# EAGLE design Sidekick-v02 (EAGLE 5.09)
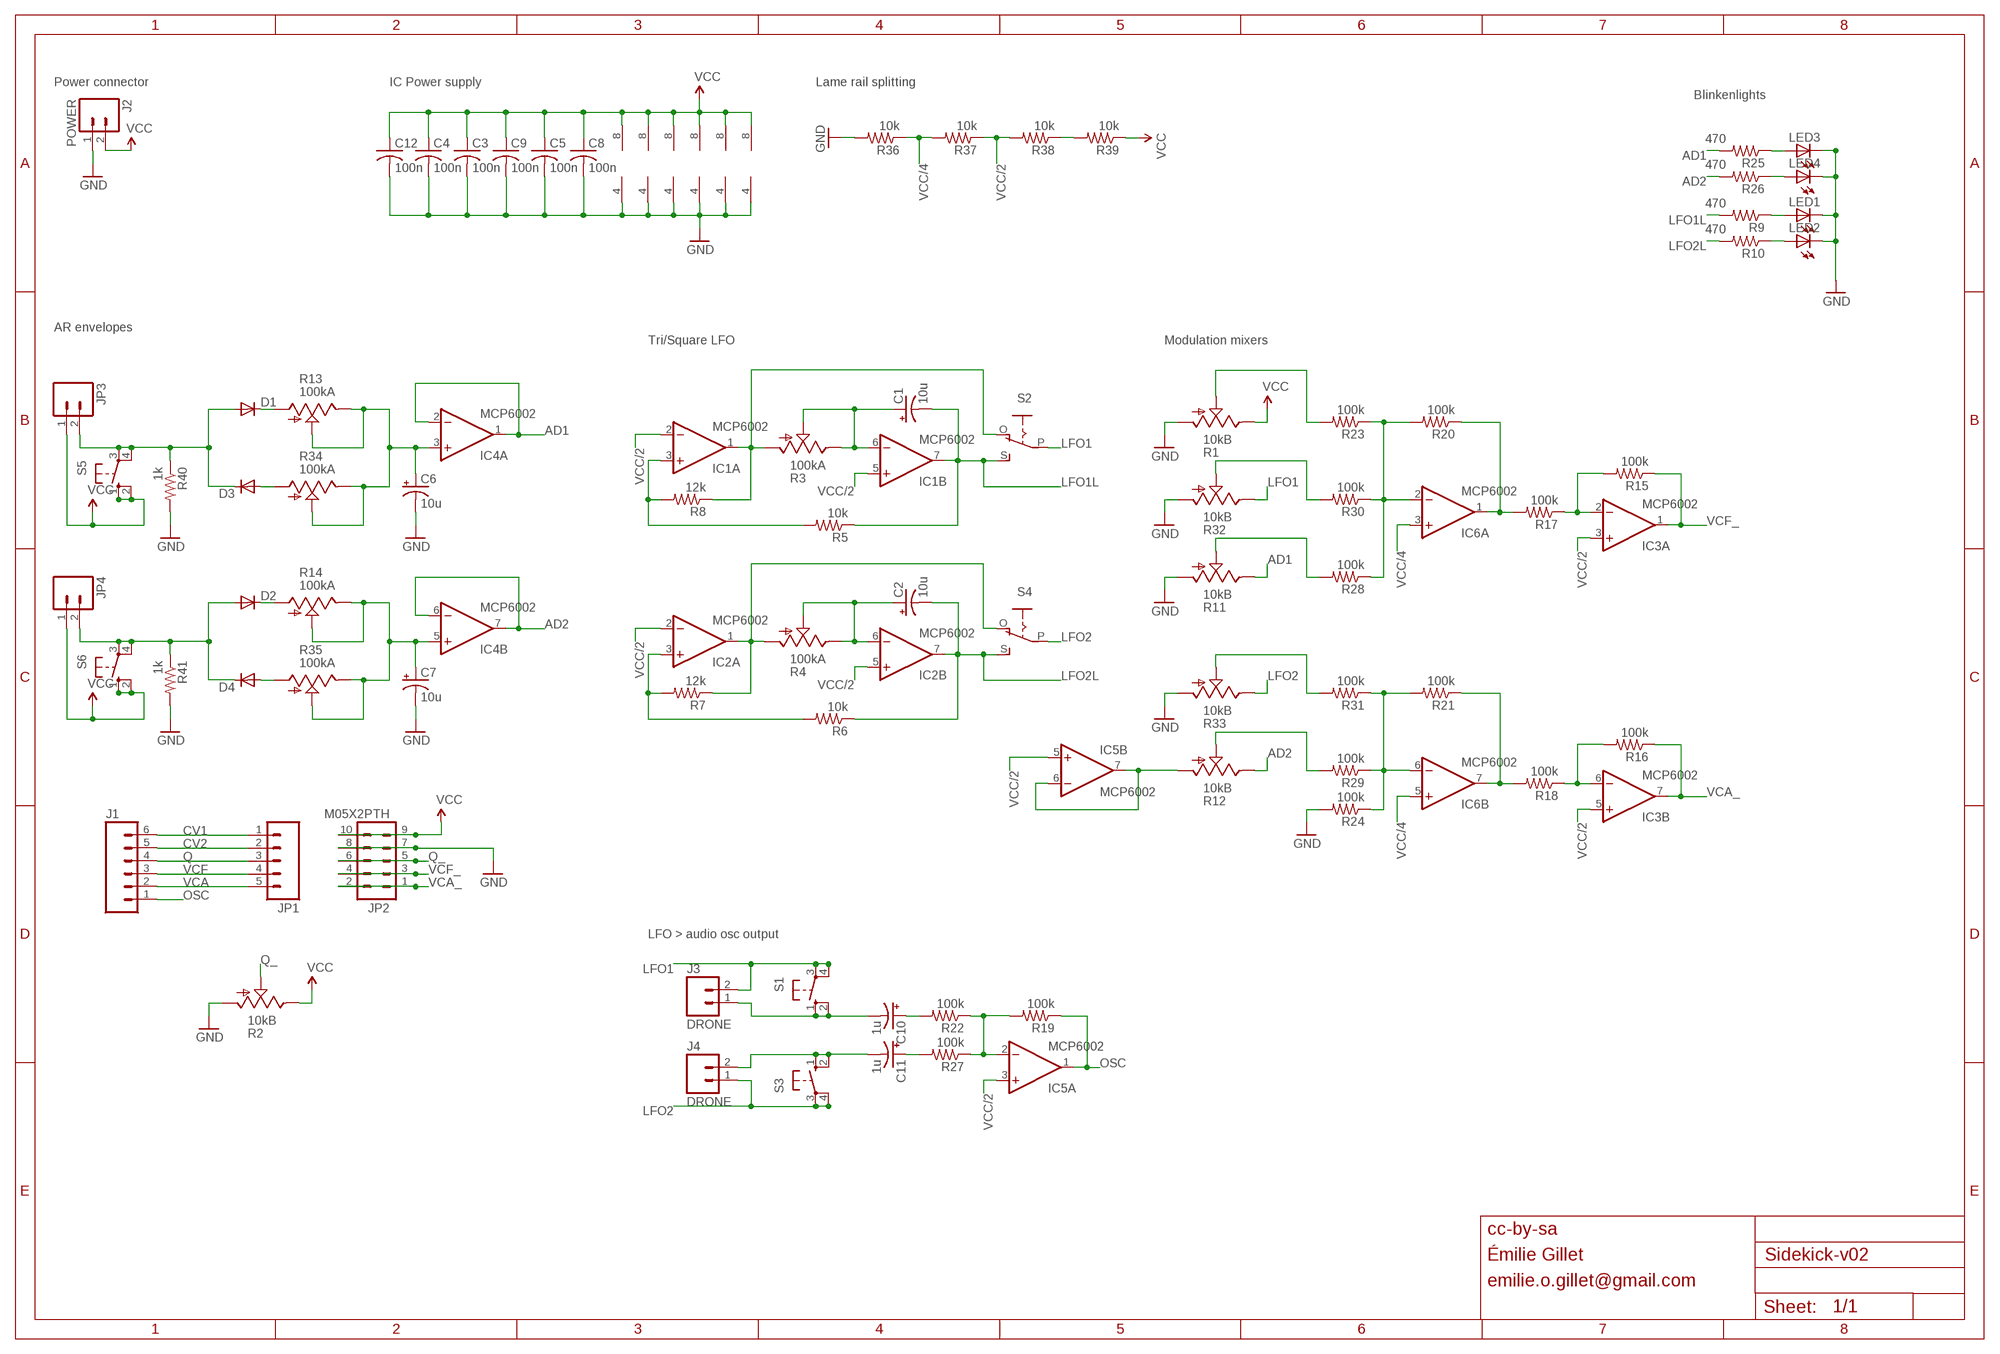
[diagram p0: schematic, sheet 1]

## Parts
C1  10u  CPOL-USE2.5-6  [E2,5-6]
C2  10u  CPOL-USE2.5-6  [E2,5-6]
C3  100n  C-US025-024X044  [C025-024X044]
C4  100n  C-US025-024X044  [C025-024X044]
C5  100n  C-US025-024X044  [C025-024X044]
C6  10u  CPOL-USE2.5-6  [E2,5-6]
C7  10u  CPOL-USE2.5-6  [E2,5-6]
C8  100n  C-US025-024X044  [C025-024X044]
C9  100n  C-US025-024X044  [C025-024X044]
C10  1u  CPOL-USE2.5-6  [E2,5-6]
C11  1u  CPOL-USE2.5-6  [E2,5-6]
C12  100n  C-US025-024X044  [C025-024X044]
D1  DIODE-D-5  [D-5]
D2  DIODE-D-5  [D-5]
D3  DIODE-D-5  [D-5]
D4  DIODE-D-5  [D-5]
IC1  MCP6002  TL082P  [DIL08]
IC2  MCP6002  TL082P  [DIL08]
IC3  MCP6002  TL082P  [DIL08]
IC4  MCP6002  TL082P  [DIL08]
IC5  MCP6002  TL082P  [DIL08]
IC6  MCP6002  TL082P  [DIL08]
J1  M06SIP  [1X06]
J2  POWER  M02PTH  [1X02]
J3  DRONE  M02PTH  [1X02]
J4  DRONE  M02PTH  [1X02]
JP1  M05PTH  [1X05]
JP2  M05X2PTH  [AVR_ICSP]
JP3  M02  [1X02_LONGPADS]
JP4  M02  [1X02_LONGPADS]
LED1  LED3MM  [LED3MM]
LED2  LED3MM  [LED3MM]
LED3  LED3MM  [LED3MM]
LED4  LED3MM  [LED3MM]
R1  10kB  POT_US  [ALPS_POT_SFE]
R2  10kB  POT_US  [ALPS_POT_SFE]
R3  100kA  POT_US  [ALPS_POT_SFE]
R4  100kA  POT_US  [ALPS_POT_SFE]
R5  10k  R-US_0204/7  [0204/7]
R6  10k  R-US_0204/7  [0204/7]
R7  12k  R-US_0204/7  [0204/7]
R8  12k  R-US_0204/7  [0204/7]
R9  470  R-US_0204/7  [0204/7]
R10  470  R-US_0204/7  [0204/7]
R11  10kB  POT_US  [ALPS_POT_SFE]
R12  10kB  POT_US  [ALPS_POT_SFE]
R13  100kA  POT_US  [ALPS_POT_SFE]
R14  100kA  POT_US  [ALPS_POT_SFE]
R15  100k  R-US_0204/7  [0204/7]
R16  100k  R-US_0204/7  [0204/7]
R17  100k  R-US_0204/7  [0204/7]
R18  100k  R-US_0204/7  [0204/7]
R19  100k  R-US_0204/7  [0204/7]
R20  100k  R-US_0204/7  [0204/7]
R21  100k  R-US_0204/7  [0204/7]
R22  100k  R-US_0204/7  [0204/7]
R23  100k  R-US_0204/7  [0204/7]
R24  100k  R-US_0204/7  [0204/7]
R25  470  R-US_0204/7  [0204/7]
R26  470  R-US_0204/7  [0204/7]
R27  100k  R-US_0204/7  [0204/7]
R28  100k  R-US_0204/7  [0204/7]
R29  100k  R-US_0204/7  [0204/7]
R30  100k  R-US_0204/7  [0204/7]
R31  100k  R-US_0204/7  [0204/7]
R32  10kB  POT_US  [ALPS_POT_SFE]
R33  10kB  POT_US  [ALPS_POT_SFE]
R34  100kA  POT_US  [ALPS_POT_SFE]
R35  100kA  POT_US  [ALPS_POT_SFE]
R36  10k  R-US_0204/7  [0204/7]
R37  10k  R-US_0204/7  [0204/7]
R38  10k  R-US_0204/7  [0204/7]
R39  10k  R-US_0204/7  [0204/7]
R40  1k  R-US_0204/7  [0204/7]
R41  1k  R-US_0204/7  [0204/7]
S1  40-XX  [B3F-40XX]
S2  EG1218S  [EG1218]
S3  40-XX  [B3F-40XX]
S4  EG1218S  [EG1218]
S5  40-XX  [B3F-40XX]
S6  40-XX  [B3F-40XX]

## Nets
AD1: IC4.1(A:OUT) IC4.2(A:-IN) R11.P$1(E) R25.2
AD2: IC4.6(B:-IN) IC4.7(B:OUT) R12.P$1(E) R26.2
CV1: J1.6 JP1.1
CV2: J1.5 JP1.2
GND: C3.2 C4.2 C5.2 C6.- C7.- C8.2 C9.2 C12.2 IC1.4(P:V-) IC2.4(P:V-) IC3.4(P:V-) IC4.4(P:V-) IC5.4(P:V-) IC6.4(P:V-) J2.1 JP2.7 JP2.8 LED1.K(C) LED2.K(C) LED3.K(C) LED4.K(C) R1.P$3(A) R2.P$3(A) R11.P$3(A) R24.2 R32.P$3(A) R33.P$3(A) R36.2 R40.2 R41.2
LFO1: J3.2 R32.P$1(E) S1.3(P) S1.4(P1) S2.P
LFO1L: C1.- IC1.7(B:OUT) R5.1 R9.2 S2.S
LFO2: J4.1 R33.P$1(E) S3.3(P) S3.4(P1) S4.P
LFO2L: C2.- IC2.7(B:OUT) R6.1 R10.2 S4.S
N$1: C11.- J4.2 S3.1(S) S3.2(S1)
N$2: D1.C R13.P$3(A)
N$3: D3.A R34.P$3(A)
N$4: R30.2 R32.P$2(S)
N$5: D2.C R14.P$3(A)
N$6: D4.A R35.P$3(A)
N$7: C6.+ IC4.3(A:+IN) R13.P$1(E) R13.P$2(S) R34.P$1(E) R34.P$2(S)
N$8: C7.+ IC4.5(B:+IN) R14.P$1(E) R14.P$2(S) R35.P$1(E) R35.P$2(S)
N$9: IC6.2(A:-IN) R20.2 R23.1 R28.1 R30.1
N$10: D1.A D3.C JP3.2 R40.1 S5.3(P) S5.4(P1)
N$11: D2.A D4.C JP4.2 R41.1 S6.3(P) S6.4(P1)
N$12: C1.+ IC1.6(B:-IN) R3.P$1(E) R3.P$2(S)
N$13: LED3.A R25.1
N$14: LED4.A R26.1
N$15: R1.P$2(S) R23.2
N$16: R11.P$2(S) R28.2
N$17: IC6.1(A:OUT) R17.2 R20.1
N$18: IC3.2(A:-IN) R15.2 R17.1
N$19: IC6.6(B:-IN) R21.2 R24.1 R29.1 R31.1
N$20: R31.2 R33.P$2(S)
N$21: R12.P$2(S) R29.2
N$22: IC1.3(A:+IN) R5.2 R8.2
N$23: IC6.7(B:OUT) R18.2 R21.1
N$24: IC3.6(B:-IN) R16.2 R18.1
N$25: IC1.1(A:OUT) R3.P$3(A) R8.1 S2.O
N$26: IC2.3(A:+IN) R6.2 R7.2
N$28: C2.+ IC2.6(B:-IN) R4.P$1(E) R4.P$2(S)
N$29: IC2.1(A:OUT) R4.P$3(A) R7.1 S4.O
N$32: IC5.2(A:-IN) R19.2 R22.1 R27.1
N$34: LED1.A R9.1
N$35: R38.1 R39.2
N$36: LED2.A R10.1
N$43: C11.+ R27.2
N$44: C10.+ R22.2
N$46: C10.- J3.1 S1.1(S) S1.2(S1)
NETX: IC5.6(B:-IN) IC5.7(B:OUT) R12.P$3(A)
OSC: IC5.1(A:OUT) J1.1 R19.1
Q: J1.4 JP1.3
Q_: JP2.5 JP2.6 R2.P$2(S)
VCA: J1.2 JP1.5
VCA_: IC3.7(B:OUT) JP2.1 JP2.2 R16.1
VCC: C3.1 C4.1 C5.1 C8.1 C9.1 C12.1 IC1.8(P:V+) IC2.8(P:V+) IC3.8(P:V+) IC4.8(P:V+) IC5.8(P:V+) IC6.8(P:V+) J2.2 JP2.9 JP2.10 JP3.1 JP4.1 R1.P$1(E) R2.P$1(E) R39.1 S5.1(S) S5.2(S1) S6.1(S) S6.2(S1)
VCC/2: IC1.2(A:-IN) IC1.5(B:+IN) IC2.2(A:-IN) IC2.5(B:+IN) IC3.3(A:+IN) IC3.5(B:+IN) IC5.3(A:+IN) IC5.5(B:+IN) R37.1 R38.2
VCC/4: IC6.3(A:+IN) IC6.5(B:+IN) R36.1 R37.2
VCF: J1.3 JP1.4
VCF_: IC3.1(A:OUT) JP2.3 JP2.4 R15.1

## Notes on the sheet
- Power connector | IC Power supply | Lame rail splitting
- Blinkenlights
- AR envelopes
- Tri/Square LFO | Modulation mixers
- LFO > audio osc output
- cc-by-sa
- Émilie Gillet
- emilie.o.gillet@gmail.com

## Library data of the parts
C1 C2 C6 C7 C10 C11 = rcl:CPOL-US: POLARIZED CAPACITOR, American symbol
C3-C5 C8 C9 C12 = rcl:C-US: CAPACITOR, American symbol
D1-D4 = diode:DIODE-: DIODE
IC1-IC6 = gm-ics:TL082: OP AMP
J1 = SparkFun:M06: Header 6 Standard 6-pin 0.1" header. Use with straight break away headers (SKU : PRT-00116), right angle break away headers (PRT-00553), swiss pins (PRT-00743), machine pins (PRT-00117), and female headers (PRT-00115). Molex polarized connector foot print use with SKU : PRT-08094 with associated crimp pins and housings. NOTES ON THE VARIANTS LOCK and LOCK_LONGPADS... This footprint was designed to help hold the alignment of a through-hole component (i.e. 6-pin header) while soldering it into place. You may notice that each hole has been shifted either up or down by 0.005 of an inch from it's more standard position (which is a perfectly straight line). This slight alteration caused the pins (the squares in the middle) to touch the edges of the holes. Because they are alternating, it causes a "brace" to hold the component in place. 0.005 has proven to be the perfect amount of "off-center" position when using our standard breakaway headers. Although looks a little odd when you look at the bare footprint, once you have a header in there, the alteration is very hard to notice. Also, if you push a header all the way into place, it is covered up entirely on the bottom side. This idea of altering the position of holes to aid alignment will be further integrated into the Sparkfun Library for other footprints. It can help hold any component with 3 or more connection pins.
J2-J4 JP3 JP4 = SparkFun:M02: Header 2 Standard 2-pin 0.1" header. Use with straight break away headers (SKU : PRT-00116), right angle break away headers (PRT-00553), swiss pins (PRT-00743), machine pins (PRT-00117), and female headers (PRT-00115). Molex polarized connector foot print use with SKU : PRT-08233 with associated crimp pins and housings.
JP1 = SparkFun:M05: Header 5 Standard 5-pin 0.1" header. Use with straight break away headers (SKU : PRT-00116), right angle break away headers (PRT-00553), swiss pins (PRT-00743), machine pins (PRT-00117), and female headers (PRT-00115). Molex polarized connector foot print use with SKU : PRT-08230 with associated crimp pins and housings.
JP2 = SparkFun:M05X2: Header 5x2 Standard 10-pin dual row 0.1" header. Commonly used with AVR-ISP. Use with Spark Fun Electronics SKU: PRT-00778
LED1-LED4 = led:LED: LED OSRAM: - CHIPLED LG R971, LG N971, LY N971, LG Q971, LY Q971, LO R971, LY R971 LH N974, LH R974 LS Q976, LO Q976, LY Q976 LO Q996 - Hyper CHIPLED LW Q18S LB Q993, LB Q99A, LB R99A - SideLED LS A670, LO A670, LY A670, LG A670, LP A670 LB A673, LV A673, LT A673, LW A673 LH A674 LY A675 LS A676, LA A676, LO A676, LY A676, LW A676 LS A679, LY A679, LG A679 - Hyper Micro SIDELED® LS Y876, LA Y876, LO Y876, LY Y876 LT Y87S - SmartLED LW L88C, LW L88S LB L89C, LB L89S, LG L890 LS L89K, LO L89K, LY L89K LS L896, LA L896, LO L896, LY L896 - TOPLED LS T670, LO T670, LY T670, LG T670, LP T670 LSG T670, LSP T670, LSY T670, LOP T670, LYG T670 LG T671, LOG T671, LSG T671 LB T673, LV T673, LT T673, LW T673 LH T674 LS T676, LA T676, LO T676, LY T676, LB T676, LH T676, LSB T676, LW T676 LB T67C, LV T67C, LT T67C, LS T67K, LO T67K, LY T67K, LW E67C LS E67B, LA E67B, LO E67B, LY E67B, LB E67C, LV E67C, LT E67C LW T67C LS T679, LY T679, LG T679 LS T770, LO T770, LY T770, LG T770, LP T770 LB T773, LV T773, LT T773, LW T773 LH T774 LS E675, LA E675, LY E675, LS T675 LS T776, LA T776, LO T776, LY T776, LB T776 LHGB T686 LT T68C, LB T68C - Hyper Mini TOPLED® LB M676 - Mini TOPLED Santana® LG M470 LS M47K, LO M47K, LY M47K Source: http://www.osram.convergy.de LUXEON: - LUMILED® LXK2-PW12-R00, LXK2-PW12-S00, LXK2-PW14-U00, LXK2-PW14-V00 LXK2-PM12-R00, LXK2-PM12-S00, LXK2-PM14-U00 LXK2-PE12-Q00, LXK2-PE12-R00, LXK2-PE12-S00, LXK2-PE14-T00, LXK2-PE14-U00 LXK2-PB12-K00, LXK2-PB12-L00, LXK2-PB12-M00, LXK2-PB14-N00, LXK2-PB14-P00, LXK2-PB14-Q00 LXK2-PR12-L00, LXK2-PR12-M00, LXK2-PR14-Q00, LXK2-PR14-R00 LXK2-PD12-Q00, LXK2-PD12-R00, LXK2-PD12-S00 LXK2-PH12-R00, LXK2-PH12-S00 LXK2-PL12-P00, LXK2-PL12-Q00, LXK2-PL12-R00 Source: www.luxeon.com KINGBRIGHT: KA-3528ASYC Source: www.kingbright.com
R1-R4 R11-R14 R32-R35 = pot-alps:POT_US
R5-R10 R15-R31 R36-R41 = rcl:R-US_: RESISTOR, American symbol
S1 S3 S5 S6 = og-switch:40-XX: OMRON SWITCH
S2 S4 = adafruit:EG1218: SLIDING SWITCH 0.1" spacing through hole, vertical SPDT slide switch http://www.ladyada.net/library/pcb/eaglelibrary.html

## Board
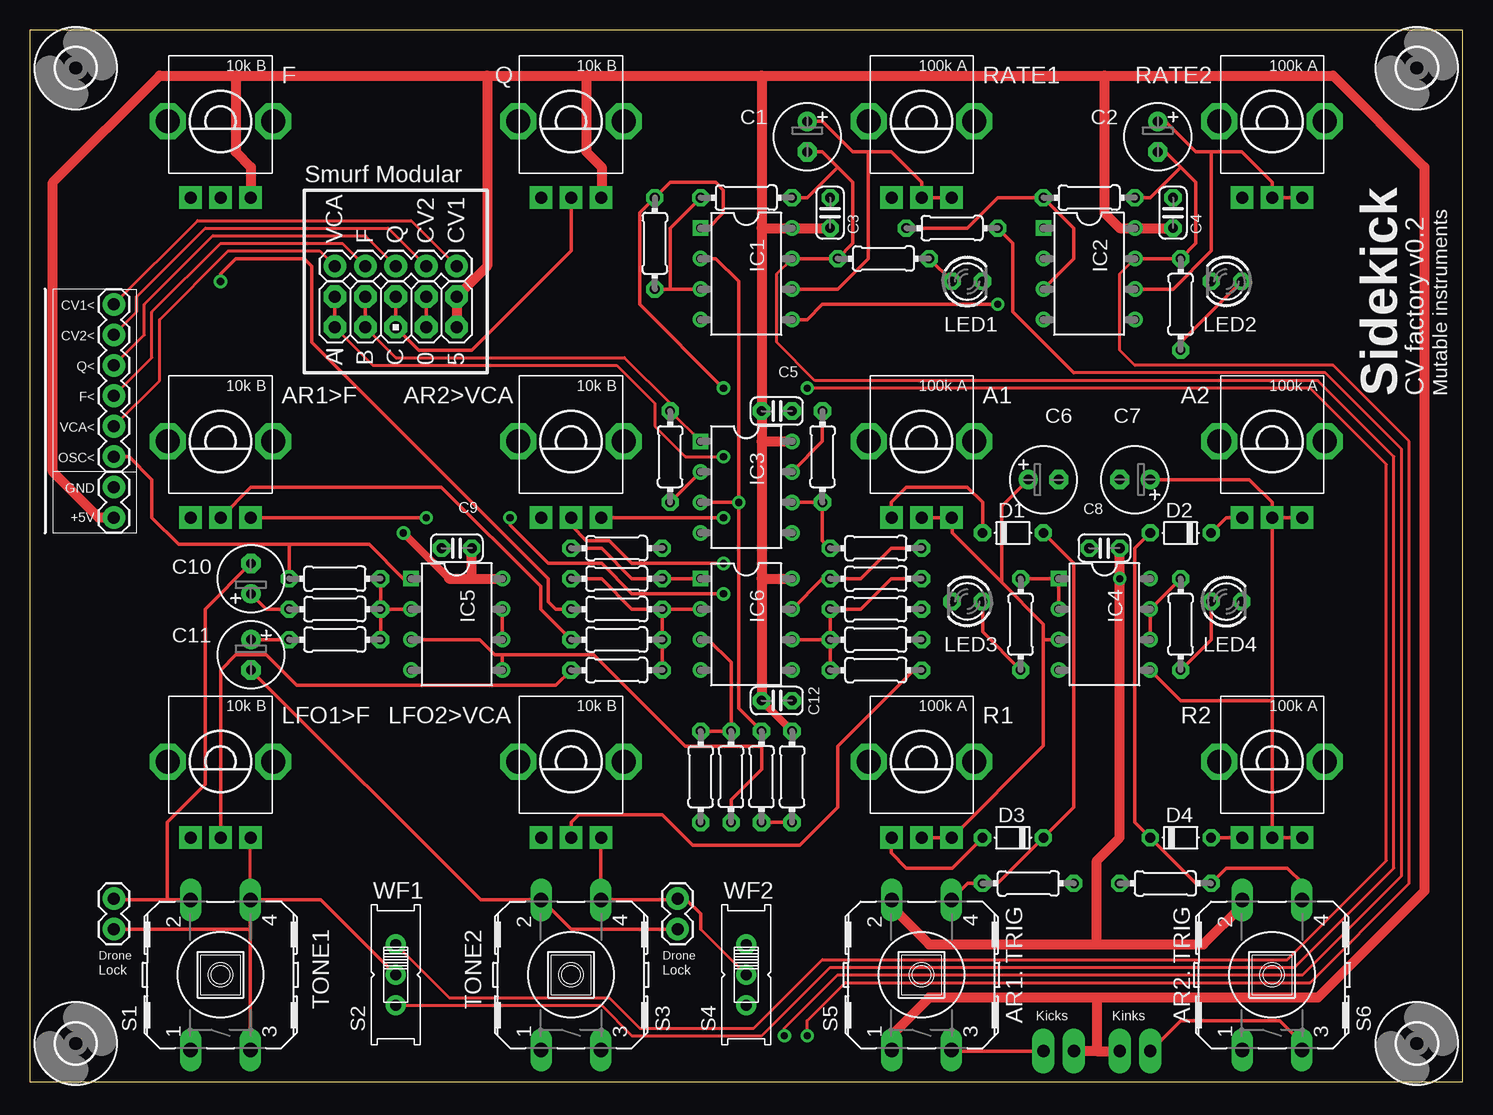
[diagram p1: board, top side]
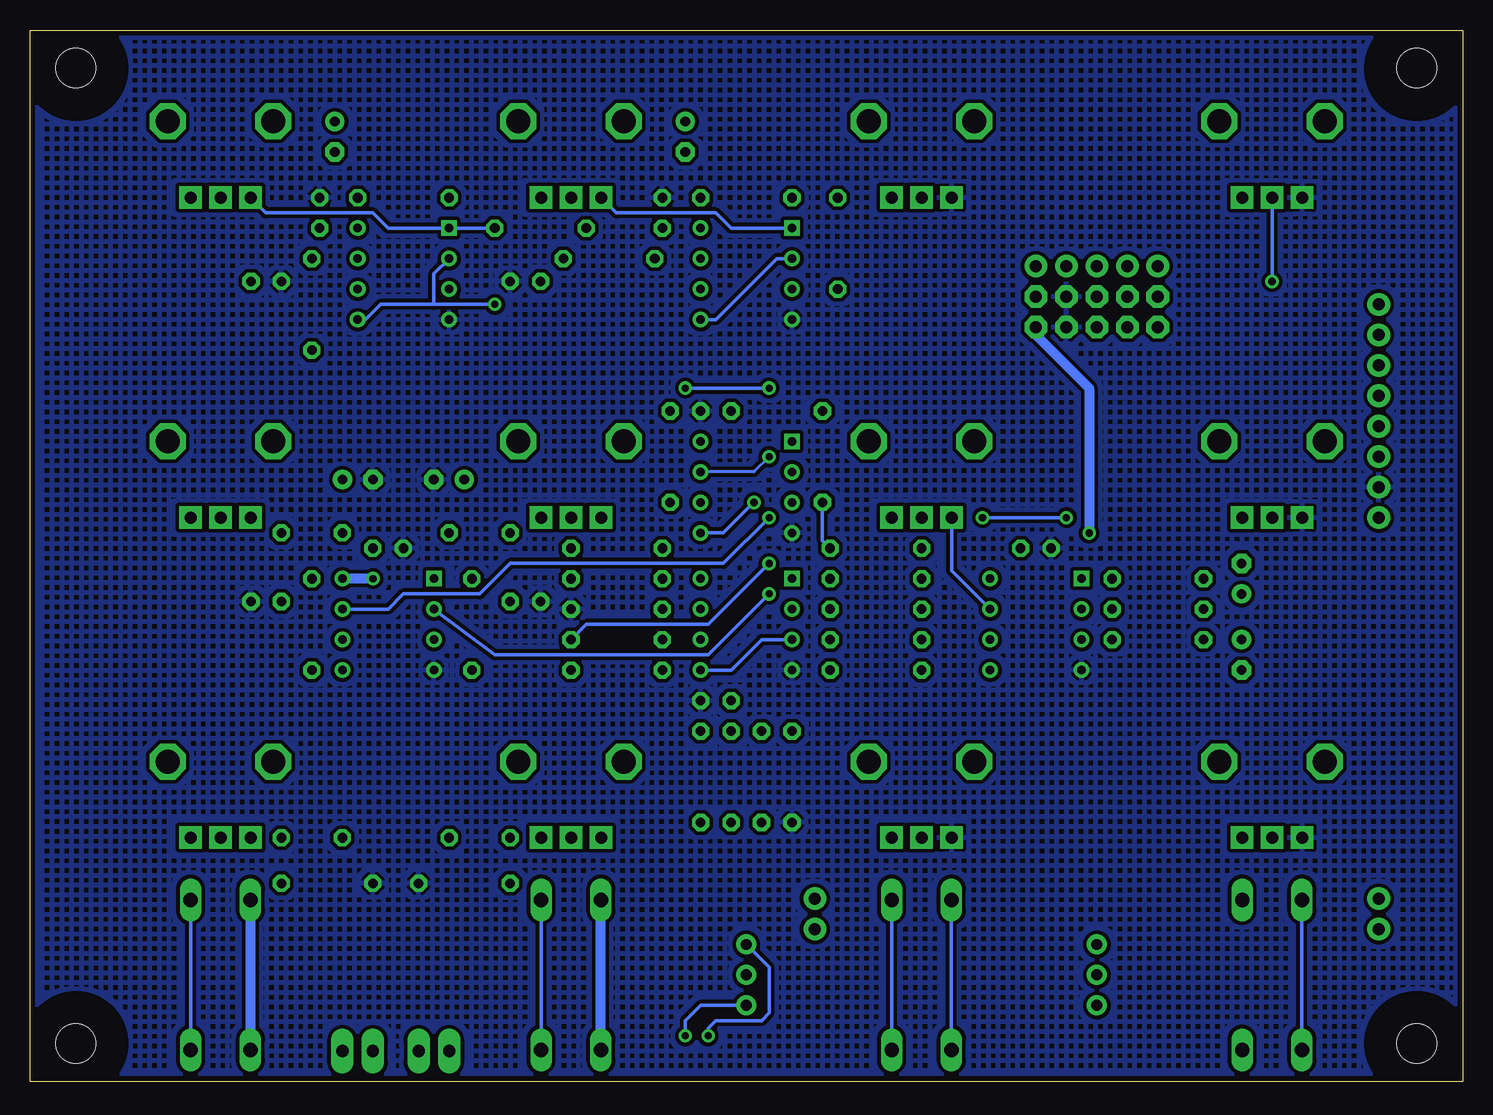
[diagram p2: board, bottom side, seen from below]

Size 119.38 x 87.63 mm. Coordinates in mm from the lower left corner, seen from the top.
Outline: 0,0 119.38,0 119.38,87.63 0,87.62 0,0
Copper layers (1*16): Top 0.035mm / dielectric 1.5mm / Bottom 0.035mm
Design rules "SparkFun *": minimum track width 8mil, minimum drill 20mil, track to track 8mil, track to pad 8mil, pad to pad 8mil, via to via 8mil, smd to smd 8mil, copper to edge 10mil, drill to drill 8mil, minimum pad ring 12mil, minimum via ring 10mil, stop-mask expansion 4mil, vias tented up to drill 25mil, thermal gap 10mil

### Footprints (pad centres in the part's own frame; a part is rotated, then mirrored left to right if it is on the bottom)
E2,5-6 = drill 0.813 pad 1.6 round: + -1.27,0 | drill 0.813 pad 1.6 octagon: - 1.27,0
C025-024X044 = drill 0.813 octagon: 1 -1.27,0; 2 1.27,0
D-5 = drill 0.813 octagon: A 2.54,0; C -2.54,0
DIL08 = drill 0.7 square: 1 -3.81,-3.81 | drill 0.7 round: 2 -1.27,-3.81; 3 1.27,-3.81; 4 3.81,-3.81; 5 3.81,3.81; 6 1.27,3.81; 7 -1.27,3.81; 8 -3.81,3.81
1X06 = drill 1.016 pad 1.88 round: 1 0,0; 2 2.54,0; 3 5.08,0; 4 7.62,0; 5 10.16,0; 6 12.7,0
1X02 = drill 1.016 pad 1.88 round: 1 0,0; 2 2.54,0
1X05 = drill 1.016 pad 1.88 round: 1 0,0; 2 2.54,0; 3 5.08,0; 4 7.62,0; 5 10.16,0
AVR_ICSP = drill 1.016 pad 1.88 octagon: 1 -1.27,5.08; 2 1.27,5.08; 3 -1.27,2.54; 4 1.27,2.54; 5 -1.27,0; 6 1.27,0; 7 -1.27,-2.54; 8 1.27,-2.54; 9 -1.27,-5.08; 10 1.27,-5.08
1X02_LONGPADS = drill 1.016 pad 1.88 long: 1 0,0; 2 2.54,0
LED3MM = drill 0.813 octagon: A -1.27,0; K 1.27,0
ALPS_POT_SFE = drill 1 pad 1.88 square: P$1 -2.5,6.35; P$2 0,6.35; P$3 2.5,6.35 | drill 2 octagon: P$4 -4.4,0; P$5 4.4,0
0204/7 = drill 0.813 octagon: 1 -3.81,0; 2 3.81,0
B3F-40XX = drill 1.194 long: 1 -6.248,2.489; 2 6.248,2.489; 3 -6.248,-2.489; 4 6.248,-2.489
EG1218 = drill 0.9 pad 1.676 round: O -2.54,0; P 0,0; S 2.54,0
3,3 = hole 3.3: 0,0

### Placement (x,y rotation side)
C1  64.77,78.74 270 top
C2  93.98,78.74 270 top
C3  66.67,72.39 90 top
C4  95.25,72.39 90 top
C5  62.23,55.88 0 top
C6  84.45,50.16 0 top
C7  92.08,50.16 180 top
C8  89.53,44.45 180 top
C9  35.56,44.45 180 top
C10  18.41,41.91 90 top
C11  18.41,35.56 270 top
C12  62.23,31.75 0 top
D1  81.92,45.72 0 top
D2  95.89,45.72 180 top
D3  81.92,20.32 180 top
D4  95.89,20.32 0 top
IC1  59.69,67.31 270 top
IC2  88.27,67.31 270 top
IC3  59.69,49.53 270 top
IC4  89.53,38.1 270 top
IC5  35.56,38.1 270 top
IC6  59.69,38.1 270 top
J1  6.99,52.07 90 top
J2  6.99,49.53 270 top
J3  6.99,15.24 270 top
J4  53.98,15.24 270 top
JP1  35.56,67.95 180 top
JP2  30.48,64.14 90 top
JP3  87,2.54 180 top
JP4  90.8,2.54 0 top
LED1  78.11,66.68 0 top
LED2  99.69,66.68 180 top
LED3  78.11,40.01 180 top
LED4  99.69,40.01 0 top
R1  15.88,80.01 180 top
R2  45.09,80.01 180 top
R3  74.3,80.01 180 top
R4  103.5,80.01 180 top
R5  59.69,73.66 180 top
R6  88.27,73.66 180 top
R7  76.83,71.12 180 top
R8  52.07,69.85 270 top
R9  71.12,68.58 180 top
R10  95.89,64.77 90 top
R11  15.88,53.34 180 top
R12  45.09,53.34 180 top
R13  74.3,53.34 180 top
R14  103.5,53.34 180 top
R15  53.34,52.07 270 top
R16  66.04,52.07 270 top
R17  48.89,44.45 180 top
R18  70.48,44.45 0 top
R19  25.4,41.91 0 top
R20  48.89,41.91 180 top
R21  70.48,41.91 0 top
R22  25.4,39.37 180 top
R23  48.89,39.37 180 top
R24  70.48,39.37 0 top
R25  82.55,38.1 90 top
R26  95.89,38.1 90 top
R27  25.4,36.83 180 top
R28  48.89,36.83 180 top
R29  70.48,36.83 0 top
R30  48.89,34.29 180 top
R31  70.48,34.29 0 top
R32  15.88,26.67 180 top
R33  45.09,26.67 180 top
R34  74.3,26.67 180 top
R35  103.5,26.67 180 top
R36  55.88,25.4 270 top
R37  58.42,25.4 90 top
R38  60.96,25.4 90 top
R39  63.5,25.4 270 top
R40  83.19,16.51 0 top
R41  94.61,16.51 180 top
S1  15.88,8.89 90 top
S2  30.48,8.89 270 top
S3  45.09,8.89 90 top
S4  59.69,8.89 270 top
S5  74.3,8.89 90 top
S6  103.5,8.89 90 top
U$1  [ORNAMENT_1]  0.64,45.09 270 top
U$2  [SARASWATI]  118.75,37.46 90 top
U$100  [3,3]  115.57,3.17 0 top
U$101  [3,3]  3.81,3.17 0 top
U$102  [3,3]  115.57,84.46 0 top
U$103  [3,3]  3.81,84.46 0 top

### Tracks (layer width: path | path; a pad name or v marks a point on that pad's centre or on a via)
AD1  (via drill 0.6)
  Top 0.305: R25.2 IC4.1 IC4.2 | R11.P$1 v33.02,46.99 | v40.01,46.99 40.01,46.35 43.18,43.18 47.62,43.18 50.16,40.64 v57.78,40.64
  Bottom 0.305: v33.02,46.99 v40.01,46.99 | v57.78,40.64 62.87,35.56 80.64,35.56 IC4.2
AD2  (via drill 0.6)
  Top 0.305: IC4.6 IC4.7 R26.2 | R12.P$1 v57.78,46.99
  Bottom 0.305: v57.78,46.99 61.59,43.18 79.38,43.18 81.92,40.64 88.27,40.64 89.53,39.37 IC4.7
CV1
  Top 0.254: J1.6 13.97,71.76 31.75,71.76 JP1.1
CV2
  Top 0.254: J1.5 8.89,64.14 8.89,65.41 14.61,71.12 29.84,71.12 JP1.2
GND
  Top 0.305: JP2.7 JP2.8
  pour Bottom (isolate 0.305, hatched): 0.64,87 0.64,0.64 118.75,0.64 118.75,87
LFO1
  Top 0.254: R32.P$1 18.36,20.31 S1.4
  Top 0.305: 18.36,12.7 S1.3 | 18.36,12.7 S1.4 24.23,15.14 S2.P | J3.2 18.36,12.7
LFO1L
  Top 0.254: IC1.7 62.23,67.31 62.23,61.59 65.41,58.42 107.31,58.42 113.67,52.07 113.67,17.78 105.41,9.53 66.67,9.53 60.96,3.81 50.16,3.81 47.62,6.35 S2.S
  Top 0.305: IC1.7 R9.2 68.58,69.85 68.58,74.93 67.31,76.2 | C1.- 66.04,77.47 67.31,76.2 | 67.31,76.2 64.77,73.66 R5.1
LFO2
  Top 0.254: 47.57,20.31 R33.P$1 | 55.88,12.7 S4.P
  Top 0.305: 47.57,20.31 S3.4 53.87,15.14 J4.1 54.61,15.24 55.88,13.97 55.88,12.7
  Bottom 0.305: S3.3 S3.4
LFO2L  (via drill 0.6)
  Top 0.254: IC2.7 90.8,67.31 90.8,60.96 92.08,59.69 108.58,59.69 114.94,53.34 114.94,16.51 106.68,8.25 67.95,8.25 64.77,5.08 v64.77,3.81
  Top 0.305: IC2.7 R10.2 97.16,69.85 97.16,74.93 95.89,76.2 | C2.- 94.61,77.47 95.89,76.2 | 95.89,76.2 93.34,73.66 R6.1
  Bottom 0.305: S4.S 63.5,6.35 64.77,5.08 v64.77,3.81
N$1
  Top 0.305: 42.55,15.24 42.6,15.19 S3.2 | C11.- 37.57,15.14 S3.2 | S3.2 42.65,15.14 45.09,12.7 J4.2
  Bottom 0.305: S3.1 S3.2
N$2
  Top 0.305: R13.P$3 71.75,47.03 71.75,48.26 73.03,49.53 78.11,49.53 79.38,48.26 D1.C
N$3
  Top 0.203: R34.P$3 71.75,20.32 71.75,20.28
  Top 0.305: 71.75,20.28 71.75,19.05 73.03,17.78 76.83,17.78 D3.A
N$4
  Top 0.305: R32.P$2 15.88,34.29 17.14,35.56 19.68,35.56 22.23,33.02 43.81,33.02 R30.2
N$5
  Top 0.305: D2.C 99.69,46.99 R14.P$3
N$6
  Top 0.305: D4.A R35.P$3
N$7
  Top 0.305: R34.P$2 R34.P$1 84.45,27.98 84.45,36.83 | R13.P$2 R13.P$1 76.83,46.99 76.83,45.72 80.96,41.59 | 84.45,36.83 IC4.3 | 84.45,36.83 84.45,38.1 80.96,41.59 | C6.+ 80.96,47.94 80.96,41.59
N$8
  Top 0.305: R35.P$1 R35.P$2 103.5,31.75 | R14.P$2 R14.P$1 | C7.+ 101.6,50.16 103.5,48.26 R14.P$2 | IC4.5 95.89,31.75 103.5,31.75 | 103.5,31.75 R14.P$2
N$9
  Top 0.305: R23.1 IC6.2 | R23.1 R28.1 R30.1 | R20.2 47.62,41.91 50.16,39.37 R23.1
N$10
  Top 0.305: S5.4 78.16,16.51 R40.1 80.64,16.51 D3.C 87,22.86 87,43.18 D1.A | S5.3 76.89,2.54 JP3.2
  Bottom 0.305: S5.3 S5.4
N$11
  Top 0.305: S6.4 106.05,15.19 106.05,16.51 104.78,17.78 99.69,17.78 R41.1 97.16,16.51 D4.C 92.08,21.59 92.08,44.45 D2.A | JP4.2 95.89,5.08 104.14,5.08 105.99,3.23 S6.3
  Bottom 0.305: S6.3 S6.4
N$12
  Top 0.305: C1.+ 66.04,80.01 68.58,77.47 69.85,77.47 | 69.85,77.47 71.75,77.47 74.3,74.93 R3.P$2 R3.P$1 | IC1.6 67.31,66.04 69.85,68.58 69.85,77.47
N$13
  Top 0.305: R25.1 79.38,37.46 LED3.A
N$14
  Top 0.305: R26.1 98.42,36.83 LED4.A
N$15  (via drill 0.6)
  Top 0.305: R23.2 43.81,39.37 43.18,40.01 43.18,41.91 23.5,61.59 23.5,67.95 22.86,68.58 17.14,68.58 15.88,67.31 v15.88,66.68
  Bottom 0.305: v15.88,66.68 R1.P$2
N$16
  Top 0.305: R11.P$2 18.41,49.53 34.29,49.53 42.55,41.27 42.55,39.37 R28.2
N$17
  Top 0.305: IC6.1 R20.1 50.16,41.91 47.62,44.45 R17.2
N$18
  Top 0.305: R15.2 IC3.2
  Bottom 0.305: R15.2 53.34,45.09 R17.1
N$19
  Top 0.305: IC6.6 R29.1 | R29.1 R24.1 69.22,39.37 71.75,41.91 R21.2 | R29.1 R31.1
N$20
  Top 0.305: R33.P$2 45.09,21.59 45.72,22.22 52.7,22.22 55.24,19.68 64.14,19.68 67.31,22.86 67.31,27.94 73.66,34.29 R31.2
N$21  (via drill 0.6)
  Top 0.305: R12.P$2 45.09,46.35 46.35,45.09 48.26,45.09 50.16,43.18 v57.78,43.18
  Bottom 0.305: v57.78,43.18 62.87,38.1 73.03,38.1 R29.2
N$22
  Top 0.305: R8.2 53.34,66.04 | 53.34,66.04 IC1.3 | R5.2 53.34,71.12 53.34,66.04
N$23
  Top 0.305: R18.2 71.75,44.45 69.22,41.91 R21.1 66.04,41.91 IC6.7
N$24
  Top 0.305: IC3.6 R16.2 66.04,45.09 R18.1
N$25  (via drill 0.6)
  Top 0.254: S2.O 34.93,6.99 48.26,6.99 50.8,4.45 60.33,4.45 66.04,10.16 104.78,10.16 113.03,18.41 113.03,51.44 106.68,57.78 v64.77,57.78
  Top 0.305: v57.78,57.78 50.8,64.77 50.8,72.39 R8.1 53.34,74.93 57.15,74.93 57.78,74.3 57.78,72.39 56.52,71.12 IC1.1
  Bottom 0.305: R3.P$3 70.53,72.39 62.23,72.39 60.96,71.12 IC1.1 | v64.77,57.78 v57.78,57.78
N$26
  Top 0.305: R7.2 78.11,71.12 80.64,73.66 R6.2 87,71.12 87,68.58 IC2.3
N$28
  Top 0.305: C2.+ 94.61,80.01 97.16,77.47 98.42,77.47 | 98.42,77.47 100.97,77.47 103.5,74.93 R4.P$2 R4.P$1 | IC2.6 95.25,66.04 98.42,69.22 98.42,77.47
N$29  (via drill 0.6)
  Top 0.254: 87,59.05 107.95,59.05 114.3,52.7 114.3,17.14 106.05,8.89 67.31,8.89 62.87,4.45 v62.87,3.81
  Top 0.305: 87,59.05 81.92,64.14 81.92,69.85 R7.1
  Bottom 0.305: R4.P$3 99.73,72.39 90.8,72.39 89.53,71.12 IC2.1 R7.1 | S4.O 57.78,9.53 57.78,5.71 58.42,5.08 62.23,5.08 62.87,4.45 v62.87,3.81
N$32
  Top 0.305: R22.1 R19.2 | R27.1 R22.1 | R22.1 IC5.2
N$34
  Top 0.305: LED1.A R9.1
N$35
  Top 0.305: R38.1 R39.2
N$36
  Top 0.305: R10.1 95.89,61.59 LED2.A
N$43
  Top 0.305: C11.+ R27.2
N$44
  Top 0.305: C10.+ 19.68,39.37 R22.2
N$46
  Top 0.305: C10.- 14.61,39.37 14.61,24.77 11.43,21.59 11.43,15.14 | J3.1 7.09,15.14 11.43,15.14 | S1.2 11.43,15.14
  Bottom 0.305: S1.1 S1.2
NETX
  Top 0.305: IC5.6 IC5.7
  Bottom 0.305: IC5.7 42.59,42.59 R12.P$3
OSC
  Top 0.305: IC5.1 31.11,41.91 28.26,44.77 21.59,44.77 | J1.1 8.26,52.07 10.16,50.16 10.16,46.99 12.38,44.77 21.59,44.77 | 21.59,44.77 R19.1
Q
  Top 0.254: J1.4 9.53,62.23 9.53,64.77 15.24,70.48 27.94,70.48 JP1.3
Q_
  Top 0.305: JP2.6 JP2.5 32.38,60.96 36.83,60.96 45.09,69.22 R2.P$2
VCA
  Top 0.254: J1.2 10.79,58.42 10.79,63.5 16.51,69.22 24.13,69.22 JP1.5
VCA_  (via drill 0.6)
  Top 0.254: JP2.1 28.57,59.69 48.89,59.69 52.07,56.52 52.07,54.61 54.61,52.07 v57.78,52.07
  Top 0.305: JP2.1 JP2.2 | IC3.7 66.04,53.34 R16.1
  Bottom 0.254: v57.78,52.07 59.05,50.8 IC3.7
VCC  (via drill 0.6)
  Top 0.203: S6.2 100.97,15.24 100.97,15.09
  Top 0.61: C12.1 R39.1 | v31.11,45.72 34.93,41.91
  Top 0.813: R1.P$1 18.41,73.7 18.41,76.2 17.14,77.47 17.14,83.82 | 17.14,83.82 10.79,83.82 1.91,74.93 1.91,50.8 5.71,46.99 J2.2 | R2.P$1 47.62,73.7 47.62,76.2 46.35,77.47 46.35,83.82 | 17.14,83.82 38.1,83.82 | 38.1,83.82 46.35,83.82 | 60.96,71.12 IC1.8 C3.1 | 60.96,83.82 60.96,71.12 | 46.35,83.82 60.96,83.82 | 89.53,83.82 89.53,72.39 90.8,71.12 IC2.8 C4.1 | 60.96,83.82 89.53,83.82 | 89.53,83.82 108.58,83.82 116.2,76.2 116.2,15.88 107.31,6.99 88.9,6.99 | 60.96,41.91 IC6.8 | 38.1,83.82 38.1,67.95 JP2.10 JP2.9 | 60.96,41.91 C12.1 | 60.96,53.34 C5.1 60.96,71.12 | 60.96,53.34 60.96,41.91 | 60.96,53.34 IC3.8 | 34.93,41.91 36.83,41.91 | 36.83,41.91 IC5.8 | 36.83,41.91 C9.1 | 88.9,11.43 88.9,18.41 90.8,20.32 v90.8,41.91 C8.1 | 88.9,6.99 74.93,6.99 71.81,3.86 S5.1 | 88.9,2.54 JP3.1 | 88.9,2.54 JP4.1 | 88.9,6.99 88.9,2.54 | 88.9,11.43 74.93,11.43 71.81,14.55 S5.2 | 100.97,15.09 100.97,14.61 97.79,11.43 88.9,11.43
  Bottom 0.813: v90.8,41.91 IC4.8 | S6.2 S6.1 | S5.1 S5.2 | v31.11,45.72 31.11,57.78 35.56,62.23 JP2.9
VCC/2  (via drill 0.6)
  Top 0.305: 60.96,27.94 60.96,26.04 58.42,23.49 R37.1 | 60.96,27.94 R38.2 59.05,31.11 v59.05,48.26 | v59.05,48.26 IC3.3 | v59.05,48.26 59.05,66.68 57.15,68.58 IC1.2 | IC5.3 37.47,36.83 38.73,35.56 39.37,35.56 | 39.37,35.56 46.99,35.56 54.61,27.94 60.96,27.94 | IC1.5 64.77,63.5 66.04,64.77 v80.64,64.77 | 39.37,35.56 IC5.5
  Bottom 0.305: IC1.2 57.15,68.58 62.23,63.5 IC1.5 | IC3.5 61.59,45.72 v59.05,48.26 | v80.64,64.77 85.72,64.77 | 85.72,64.77 90.17,64.77 91.44,63.5 IC2.5 | IC2.2 85.72,67.31 85.72,64.77
VCC/4
  Top 0.305: R36.1 R37.2 58.42,34.92 56.52,36.83 IC6.3
  Bottom 0.305: IC6.3 58.42,36.83 60.96,34.29 IC6.5
VCF
  Top 0.254: J1.3 10.16,60.32 10.16,64.14 15.88,69.85 26.04,69.85 JP1.4
VCF_
  Top 0.254: JP2.3 30.48,60.32 49.53,60.32 53.34,56.52 R15.1 IC3.1
  Top 0.305: JP2.3 JP2.4

### Text on the board
tPlace: CV1< | CV2< | Q< | F< | VCA< | OSC< | GND | +5V
tNames: 10k B | 10k B | 100k A | 100k A | F | Q | RATE1 | RATE2 | Smurf Modular | VCA | F | Q | CV2 | CV1 | A | B | C | 0 | 5 | 10k B | 10k B | 100k A | 100k A | Sidekick | CV factory v0.2 | Mutable instruments | AR1>F | AR2>VCA | A1 | A2 | 10k B | 10k B | 100k A | 100k A | LFO1>F | LFO2>VCA | R1 | R2 | WF1 | WF2 | AR1. TRIG | AR2. TRIG | TONE1 | TONE2 | Drone | Drone | Lock | Lock | Kicks | Kinks